# Altium project TPA3116.PrjPCB
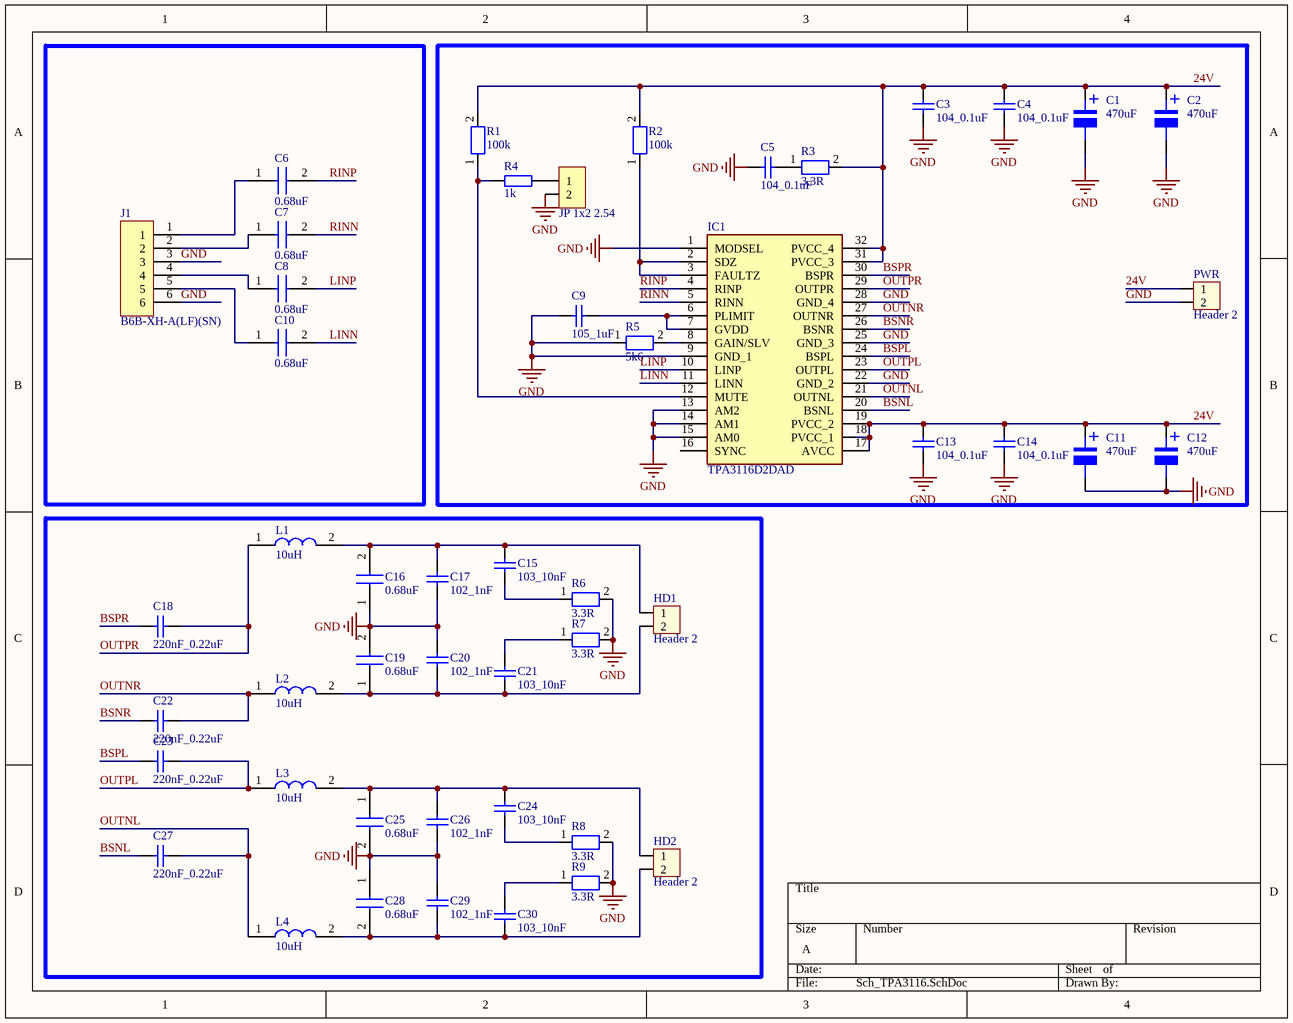
[diagram p0: Sch_TPA3116.SchDoc]
1 sheet, 49 parts. Net scope: global (net labels, ports and power ports of the same name join across sheets).
Board file: PCB_TPA3116.PcbDoc

## Sheet Sch_TPA3116.SchDoc
size A

### Parts
C1  470uF  [tu nhom 10 (G)]
C2  470uF  [tu nhom 10 (G)]
C3  104_0.1uF  [tu 0805]
C4  104_0.1uF  [tu 0805]
C5  104_0.1uF  [tu 0805]
C6  0.68uF  [B32529C0684J000]
C7  0.68uF  [B32529C0684J000]
C8  0.68uF  [B32529C0684J000]
C9  105_1uF  [tu 0805]
C10  0.68uF  [B32529C0684J000]
C11  470uF  [tu nhom 10 (G)]
C12  470uF  [tu nhom 10 (G)]
C13  104_0.1uF  [tu 0805]
C14  104_0.1uF  [tu 0805]
C15  103_10nF  [tu 0603]
C16  0.68uF  [B32529C0684J000]
C17  102_1nF  [tu 0805]
C18  220nF_0.22uF  [tu 0805]
C19  0.68uF  [B32529C0684J000]
C20  102_1nF  [tu 0805]
C21  103_10nF  [tu 0603]
C22  220nF_0.22uF  [tu 0805]
C23  220nF_0.22uF  [tu 0805]
C24  103_10nF  [tu 0603]
C25  0.68uF  [B32529C0684J000]
C26  102_1nF  [tu 0805]
C27  220nF_0.22uF  [tu 0805]
C28  0.68uF  [B32529C0684J000]
C29  102_1nF  [tu 0805]
C30  103_10nF  [tu 0603]
HD1  Header 2  [HED2]
HD2  Header 2  [HED2]
IC1  TPA3116D2DAD  [SOP65P810X120-32N]
J1  B6B-XH-A(LF)(SN)  [CON6_100_B6B-XH-A_TH_ST]
JP1  JP 1x2 2.54  [JP 1x2 DT]
L1  10uH  [ind_dr125_10uH]
L2  10uH  [ind_dr125_10uH]
L3  10uH  [ind_dr125_10uH]
L4  10uH  [ind_dr125_10uH]
PWR  Header 2  [HED2]
R1  100k  [Tro SMD 0805]
R2  100k  [Tro SMD 0805]
R3  3.3R  [Tro SMD 1206]
R4  1k  [tro smd 0805]
R5  5k6  [Tro SMD 0805]
R6  3.3R  [Tro SMD 1206]
R7  3.3R  [Tro SMD 1206]
R8  3.3R  [Tro SMD 1206]
R9  3.3R  [Tro SMD 1206]

### Nets
GND: C1.2 C2.2 C3.2 C4.2 C5.2 C9.2 C11.2 C12.2 C13.2 C14.2 C16.1 C17.2 C19.2 C20.1 C25.2 C26.1 C28.1 C29.2 IC1.1(MODSEL) IC1.9(GND_1) IC1.13(AM2) IC1.14(AM1) IC1.15(AM0) IC1.22(GND_2) IC1.25(GND_3) IC1.28(GND_4) J1.3 J1.6 JP1.2 PWR.2 R5.1 R6.2 R7.2 R8.2 R9.2
24V: C1.1 C2.1 C3.1 C4.1 C11.1 C12.1 C13.1 C14.1 IC1.17(AVCC) IC1.18(PVCC_1) IC1.19(PVCC_2) IC1.31(PVCC_3) IC1.32(PVCC_4) PWR.1 R1.2 R2.2 R3.2
BSNL: C27.2 IC1.20(BSNL)
BSNR: C22.2 IC1.26(BSNR)
BSPL: C23.2 IC1.24(BSPL)
BSPR: C18.2 IC1.30(BSPR)
LINN: C10.2 IC1.11(LINN)
LINP: C8.2 IC1.10(LINP)
OUTNL: C27.1 IC1.21(OUTNL) L4.1
OUTNR: C22.1 IC1.27(OUTNR) L2.1
OUTPL: C23.1 IC1.23(OUTPL) L3.1
OUTPR: C18.1 IC1.29(OUTPR) L1.1
RINN: C7.2 IC1.5(RINN)
RINP: C6.2 IC1.4(RINP)
NetC5_1: C5.1 R3.1
NetC6_1: C6.1 J1.1
NetC7_1: C7.1 J1.2
NetC8_1: C8.1 J1.4
NetC9_1: C9.1 IC1.6(PLIMIT) IC1.7(GVDD)
NetC10_1: C10.1 J1.5
NetC15_1: C15.1 C16.2 C17.1 HD1.1 L1.2
NetC15_2: C15.2 R6.1
NetC19_1: C19.1 C20.2 C21.2 HD1.2 L2.2
NetC21_1: C21.1 R7.1
NetC24_1: C24.1 R8.1
NetC24_2: C24.2 C25.1 C26.2 HD2.1 L3.2
NetC28_2: C28.2 C29.1 C30.1 HD2.2 L4.2
NetC30_2: C30.2 R9.1
NetIC1_2: IC1.2(SDZ) IC1.3(FAULTZ) R2.1
NetIC1_8: IC1.8(GAIN/SLV) R5.2
NetIC1_12: IC1.12(MUTE) R1.1 R4.1
NetJP1_1: JP1.1 R4.2

Not connected (* = marked no-connect by the designer): IC1 16(SYNC)

### Notes on the sheet
- (in symbol Tu Nhom 470uF 35V) +

### Library data of the parts
C1 C2 C11 C12 = Tu Nhom 470uF 35V: Dán; Don_Vi: Con; So_Chan: 2; Ten_Linh_Kien: Tụ Nhôm 470uF 35V 10x10.5MM; Ma_Hang: MH004418; Chung_Loai: Dán; Kieu_Chan: *
C3-C5 C13 C14 = Tu 0805 104 50V 10%: Dán; Don_Vi: Con; So_Chan: 2; Ten_Linh_Kien: Tụ 0805 104-100nF 10% 50V; Ma_Hang: MH004551; Chung_Loai: Dán; Kieu_Chan: *
C6-C8 C10 C16 C19 C25 C28 = 0.68uF/63V: Capacitor; Manufacturer_Name: TDK; Datasheet Link: https://product.tdk.com/system/files/dam/doc/product/capacitor/film/mkt/data_sheet/20/20/db/fc_2009/b32520_529.pdf; Height: 9.5mm; Manufacturer_Part_Number: B32529C0684J000; Arrow Part Number: B32529C0684J000; Arrow Price/Stock: https://www.arrow.com/en/products/b32529c0684j000/epcos-tdk
C9 = Tu 0805 105 50V 10%: Dán; Don_Vi: Con; So_Chan: 2; Ten_Linh_Kien: Tụ 0805 105-1uF 10% 50V; Ma_Hang: MH004552; Chung_Loai: Dán; Kieu_Chan: *
C15 C21 C24 C30 = Tu 0603 103 50V 10%: Dán; Don_Vi: Con; So_Chan: 2; Ten_Linh_Kien: Tụ 0603 103-10nF 10% 50V; Ma_Hang: MH004567; Chung_Loai: Dán; Kieu_Chan: *
C17 C20 C26 C29 = Tu 0805 102 50V 10%: Dán; Don_Vi: Con; So_Chan: 2; Ten_Linh_Kien: Tụ 0805 102-1nF 10% 50V; Ma_Hang: MH004549; Chung_Loai: Dán; Kieu_Chan: *
C18 C22 C23 C27 = Tu 0805 220nF 50V 10%: Dán; Don_Vi: Con; So_Chan: 2; Ten_Linh_Kien: Tụ 0805 220nF 50V 10%; Ma_Hang: MH008099; Chung_Loai: Dán; Kieu_Chan: *
HD1 HD2 PWR = Hed2: Header 2 (Green); Value: Header 2
IC1 = TPA3116D2DAD: Integrated Circuit; Manufacturer_Name: Texas Instruments; Datasheet Link: http://www.ti.com/lit/ds/symlink/tpa3116d2.pdf; Height: 1.2mm; Manufacturer_Part_Number: TPA3116D2DAD; Mouser Part Number: 595-TPA3116D2DAD; Mouser Price/Stock: https://www.mouser.co.uk/ProductDetail/Texas-Instruments/TPA3116D2DAD?qs=3AcK5DacLbr72W1Ouw7j4Q%3D%3D; Arrow Part Number: TPA3116D2DAD; Arrow Price/Stock: https://www.arrow.com/en/products/tpa3116d2dad/texas-instruments?region=nac
J1 = CON-PLG_6X1-100-ST-TH: 6 Pins, 1 Row 2.54mm Pitch, straight Connector, male; Manufacturer: JST; Mating Part Number: XHP-6; Crimp Part Number: ASXHSXH22K51; Alternate Part Number-1: NA; Manufacturer Part Number: B6B-XH-A(LF)(SN); Case/Package: TH-CON; Supplier-1: ARROW; Supplier Part Number-1: B6B-XH-A(LF)(SN)
JP1 = JP 1x2 2.54 Duc Thang: Cắm; Ten_Linh_Kien: Jump Đơn Đực 2.54MM 1x40P Thẳng 11MM; Don_Vi: Con; Ma_Hang: MH000903; Ghi_Chu: *; Kieu_Chan: *; Chung_Loai: Cắm
L1-L4 = ind_dr125_100_10uH
R1 R2 = R0805_100k_1%: Resistor; Manufacturer_Name: Bourns; Manufacturer_Part_Number: CR0603-FX-1202ELF; Datasheet Link: https://www.bourns.com/pdfs/chpreztr.pdf; Height: 0.55mm; Mouser Part Number: 652-CR0603FX-1202ELF; Mouser Price/Stock: https://www.mouser.com/Search/Refine.aspx?Keyword=652-CR0603FX-1202ELF; Arrow Part Number: CR0603-FX-1202ELF; Arrow Price/Stock: https://www.arrow.com/en/products/cr0603-fx-1202elf/bourns
R3 R6-R9 = R1206_3.3R_1/2W: Resistor; Manufacturer_Name: Bourns; Manufacturer_Part_Number: CR0603-FX-1202ELF; Datasheet Link: https://www.bourns.com/pdfs/chpreztr.pdf; Height: 0.55mm; Mouser Part Number: 652-CR0603FX-1202ELF; Mouser Price/Stock: https://www.mouser.com/Search/Refine.aspx?Keyword=652-CR0603FX-1202ELF; Arrow Part Number: CR0603-FX-1202ELF; Arrow Price/Stock: https://www.arrow.com/en/products/cr0603-fx-1202elf/bourns
R4 = Tro 0805 1% 1k: Dán; Don_Vi: Con; So_Chan: 2; Ten_Linh_Kien: Trở 0805 1% 1k; Ma_Hang: MH005468; Chung_Loai: Dán; Kieu_Chan: *
R5 = R0805_5k6_1%: Resistor; Manufacturer_Name: Bourns; Manufacturer_Part_Number: CR0603-FX-1202ELF; Datasheet Link: https://www.bourns.com/pdfs/chpreztr.pdf; Height: 0.55mm; Mouser Part Number: 652-CR0603FX-1202ELF; Mouser Price/Stock: https://www.mouser.com/Search/Refine.aspx?Keyword=652-CR0603FX-1202ELF; Arrow Part Number: CR0603-FX-1202ELF; Arrow Price/Stock: https://www.arrow.com/en/products/cr0603-fx-1202elf/bourns